# EasyEDA schematic 1-Schematic_New Project.json
TITLE: Sheet_1; REV: 1.0; Date: 2022-10-17; Sheet: 1/1; Drawn By: grievous; Company: Goose Corp
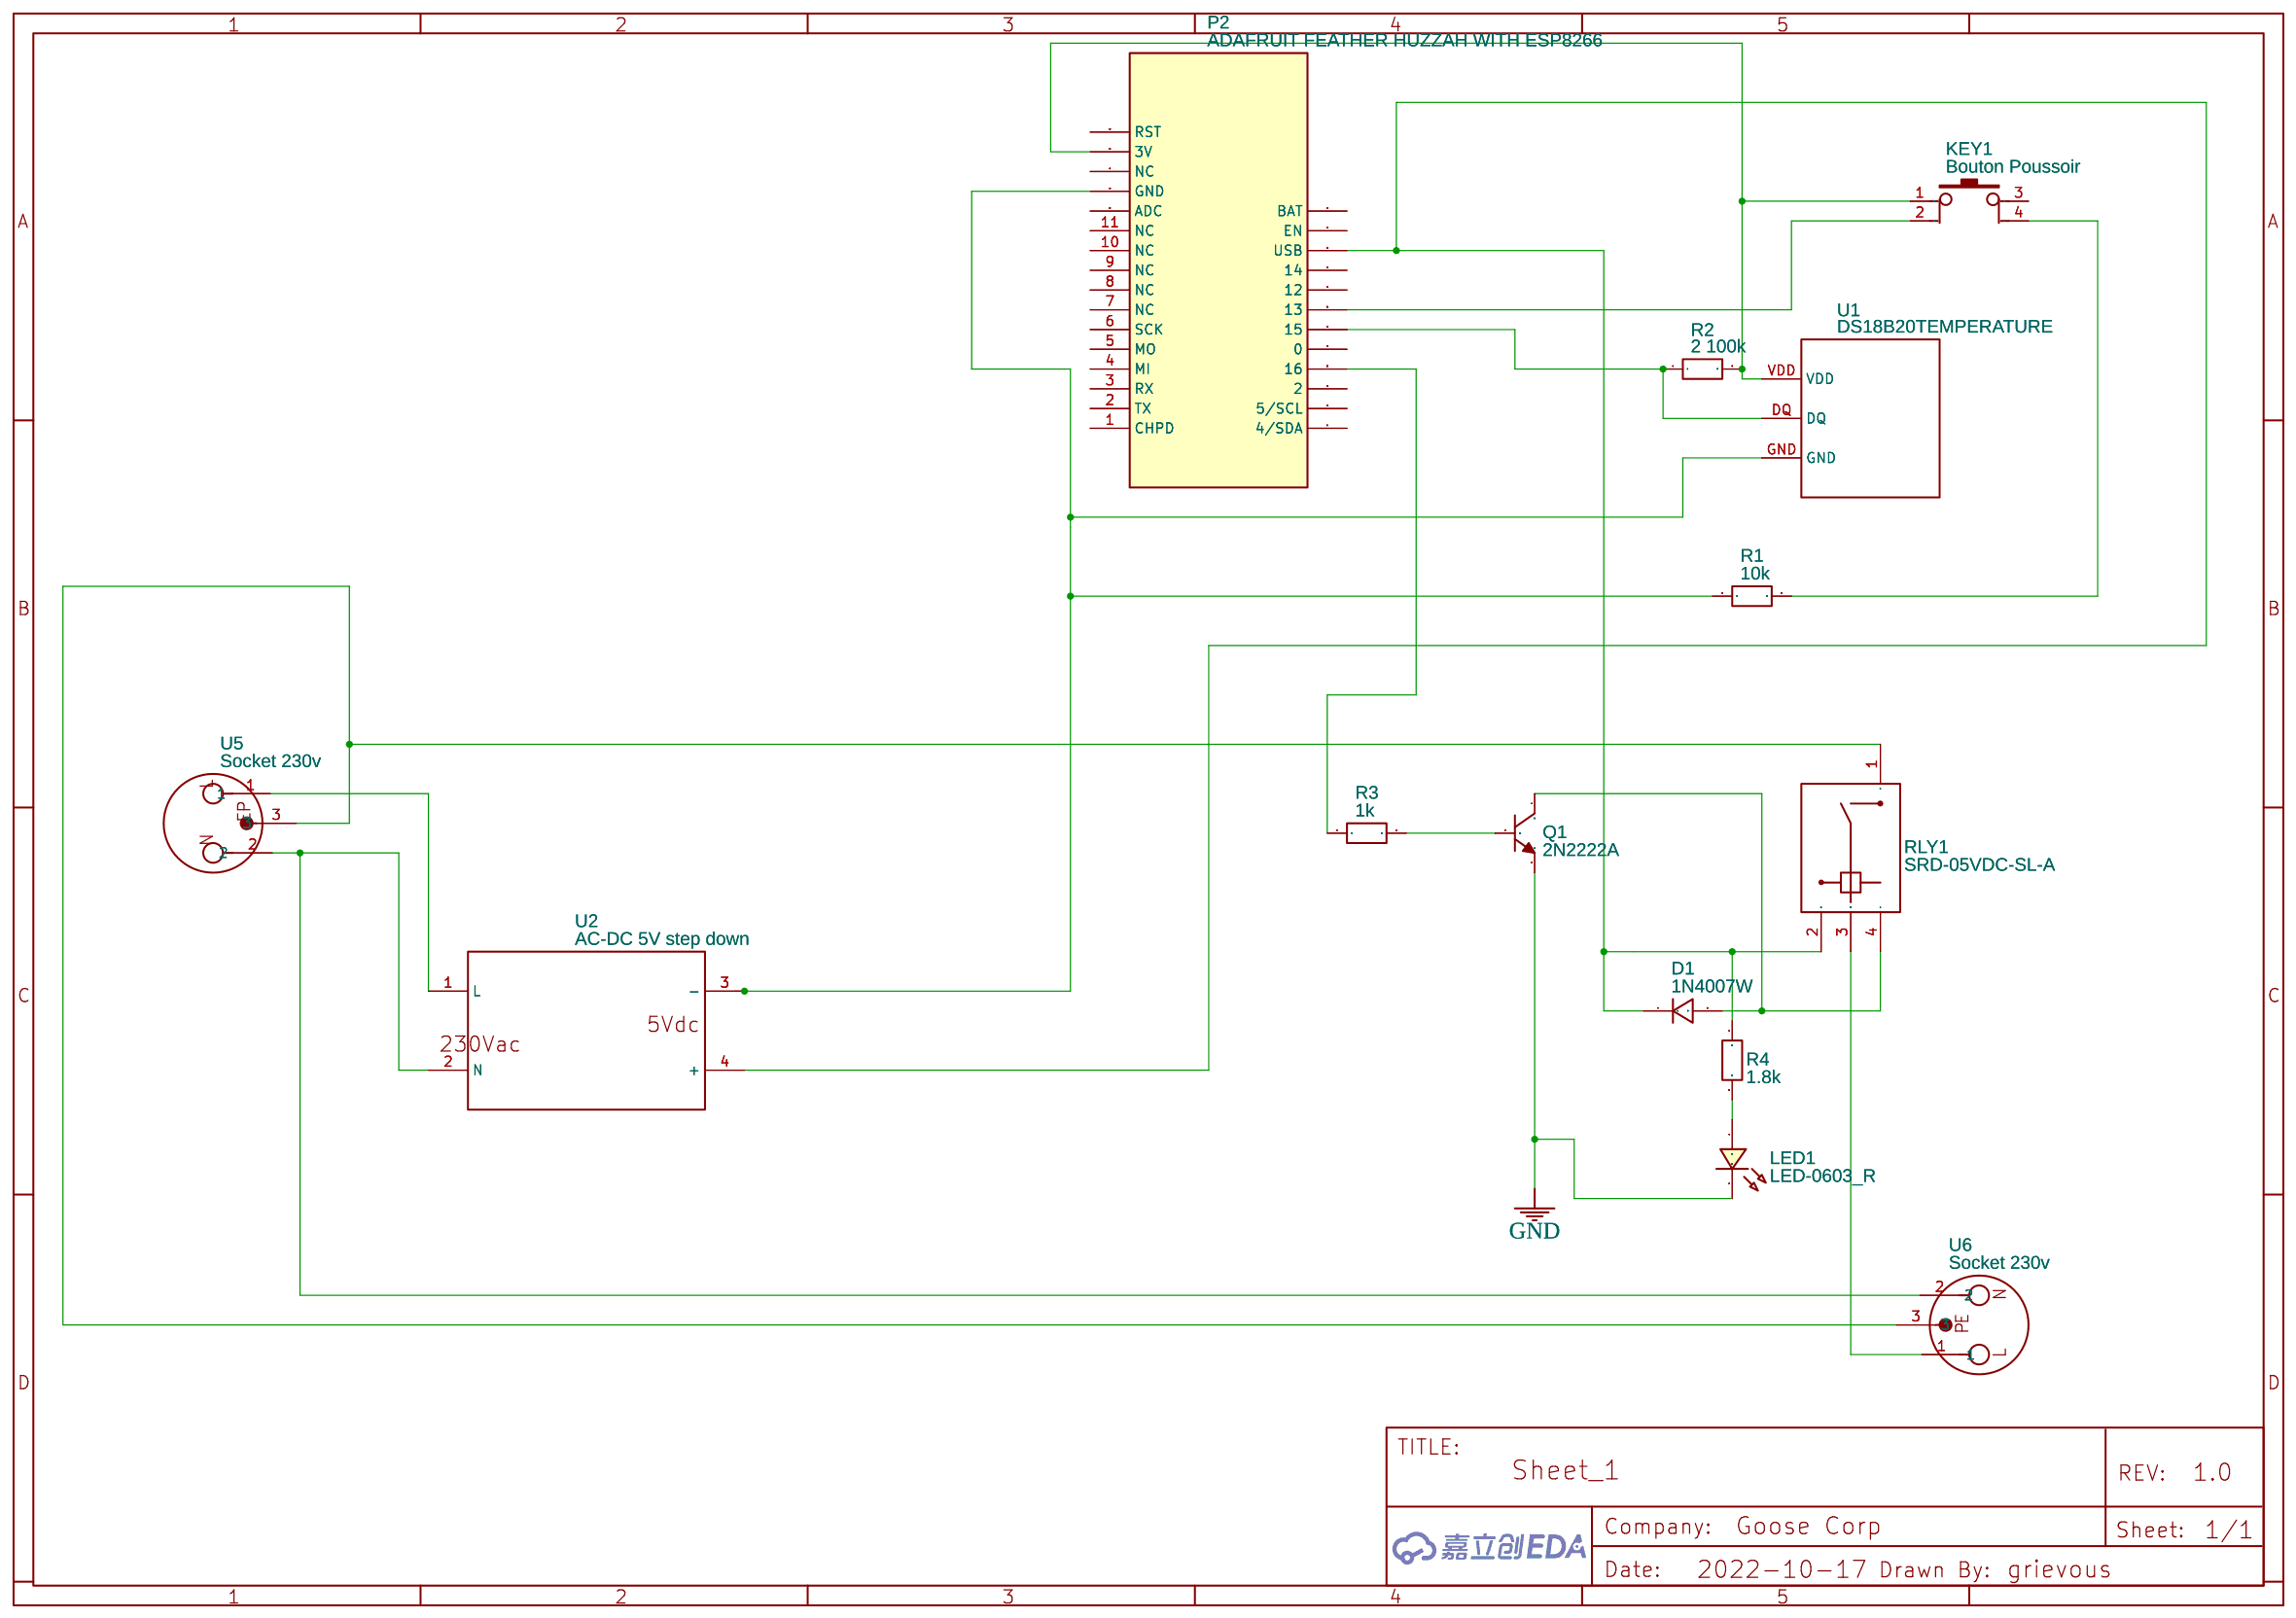
[diagram p0: schematic sheet]

## Parts
D1  1N4007W  [DO-41_BD2.5-L5.0-P8.70-D0.5-FD]
KEY1  Bouton Poussoir  [BOUTONPUSH]
LED1  LED-0603_R  [LED-TH_BD10.6-P2.54_LED10MM]
P2  ADAFRUIT FEATHER HUZZAH WITH ESP8266  [FEATHER HUZZAH WITH WIFI]
Q1  2N2222A  [TRANSISTOR2]
R1  10k  [R_AXIAL-0.5]
R2  2 100k  [R_AXIAL-0.5]
R3  1k  [R_AXIAL-0.5]
R4  1.8k  [R_AXIAL-0.5]
RLY1  SRD-05VDC-SL-A  [RELAY-TH_SRD-XXVDC-XX-A]
U1  DS18B20TEMPERATURE  [DS18B20TEMPSENSOR]
U2  AC-DC 5V step down  [AC-DC 5V SD]
U5  Socket 230v  [CONN-230V-5MM-3P]
U6  Socket 230v  [CONN-230V-5MM-3P]

## Library data of the parts
D1 = 1N4007W: Supplier: LCSC; Supplier Part: C328592; Manufacturer: BLUE ROCKET; Contributor: LCEDA_Lib
KEY1 = Bouton Poussoir: Supplier Part: C59982; Supplier: LCSC; Manufacturer: ReliaPro; Manufacturer Part: button6*6*8; image: http://image.lceda.cn/szlcsc/C59982.jpg; Contributor: digitalPatrick
LED1 = LED-0603_R: Manufacturer: EVERLIGHT(台湾亿光); Manufacturer Part: 19-217/R6C-AL1M2VY/3T; Supplier Part: C72044; Supplier: LCSC; Contributor: LCEDA_01
P2 = ADAFRUIT FEATHER HUZZAH WITH ESP8266: sourceId: 1T5FDZYC8; Contributor: electronplumber
Q1 = 2N2222A: Contributor: fmava
R1-R4 = R_0603_EU: Contributor: LCEDA_Lib
RLY1 = SRD-05VDC-SL-A: Supplier: LCSC; Supplier Part: C3036702; Manufacturer: null; JLCPCB Part Class: Extended Part; Contributor: lcsc
U1 = DS18B20TEMPERATURE: Contributor: iron_man
U2 = AC-DC 5V step down: Contributor: vinodf55
U5 U6 = Socket 230v: Supplier Part: C784941; Manufacturer: Ningbo Xinlaiya Elec.; Manufacturer Part: XY302V-3.5-3P; Contributor: FireFly DjDuchcat

## Nets
GND: LED1.2 Q1.3(E)
Net-(D1-1): D1.1 P2.26(USB) R4.1 RLY1.2 U2.4(+)
Net-(D1-2): D1.2 Q1.1(C) RLY1.4
Net-(KEY1-1): KEY1.1 P2.15(3V) R2.2 U1.VDD
Net-(KEY1-2): KEY1.2 P2.23(13)
Net-(KEY1-4): KEY1.4 R1.2
Net-(LED1-1): LED1.1 R4.2
Net-(P2-13): P2.13(GND) R1.1 U1.GND U2.3(-)
Net-(P2-20): P2.20(16) R3.1
Net-(P2-22): P2.22(15) R2.1 U1.DQ
Net-(Q1-2): Q1.2(B) R3.2
Net-(RLY1-1): RLY1.1 U5.3 U6.3
Net-(RLY1-3): RLY1.3 U6.1
Net-(U2-1): U2.1(L) U5.1
Net-(U2-2): U2.2(N) U5.2 U6.2

Not connected (* = marked no-connect by the designer): KEY1 3; P2 1(CHPD) 2(TX) 3(RX) 4(MI) 5(MO) 6(SCK) 7(NC) 8(NC) 9(NC) 10(NC) 11(NC) 12(ADC) 14(NC) 16(RST) 17(4/SDA) 18(5/SCL) 19(2) 21(0) 24(12) 25(14) 27(EN) 28(BAT)
